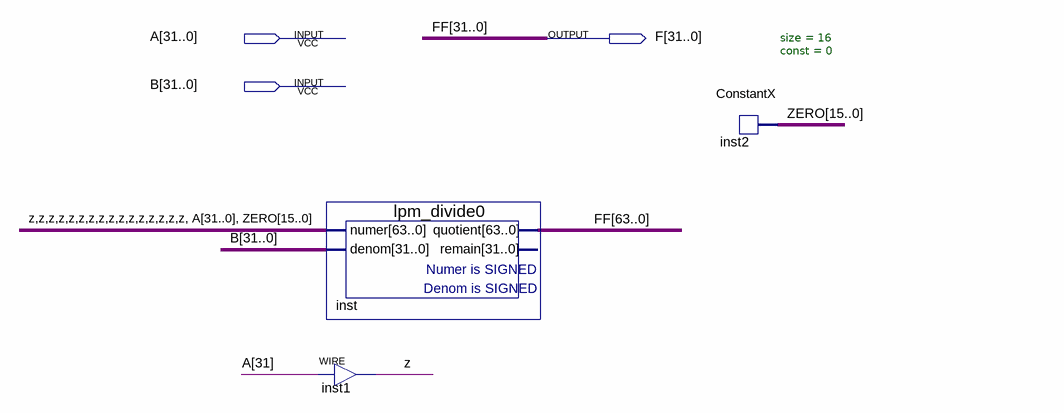
[diagram p0: schematic sheet]
// Quartus schematic real_div.bdf as structural Verilog: 3 symbols, 3 pins
module real_div (
  input  [31:0] A,
  input  [31:0] B,
  output [31:0] F
);

  wire z;
  wire [15:0] ZERO;
  wire [63:32] FF;

  lpm_divide0 inst (.numer({{16{z}}, A, ZERO}), .denom(B), .quotient({FF, F}));  // open: remain
  assign z = A[31];  // WIRE inst1
  ConstantX #(.size(16), .\const (0)) inst2 (.DATA_OUT(ZERO));

  // Other names for the same wires on the sheet: FF[31:0] = F
endmodule
